# EAGLE design me433mtc (EAGLE 7.5.0)
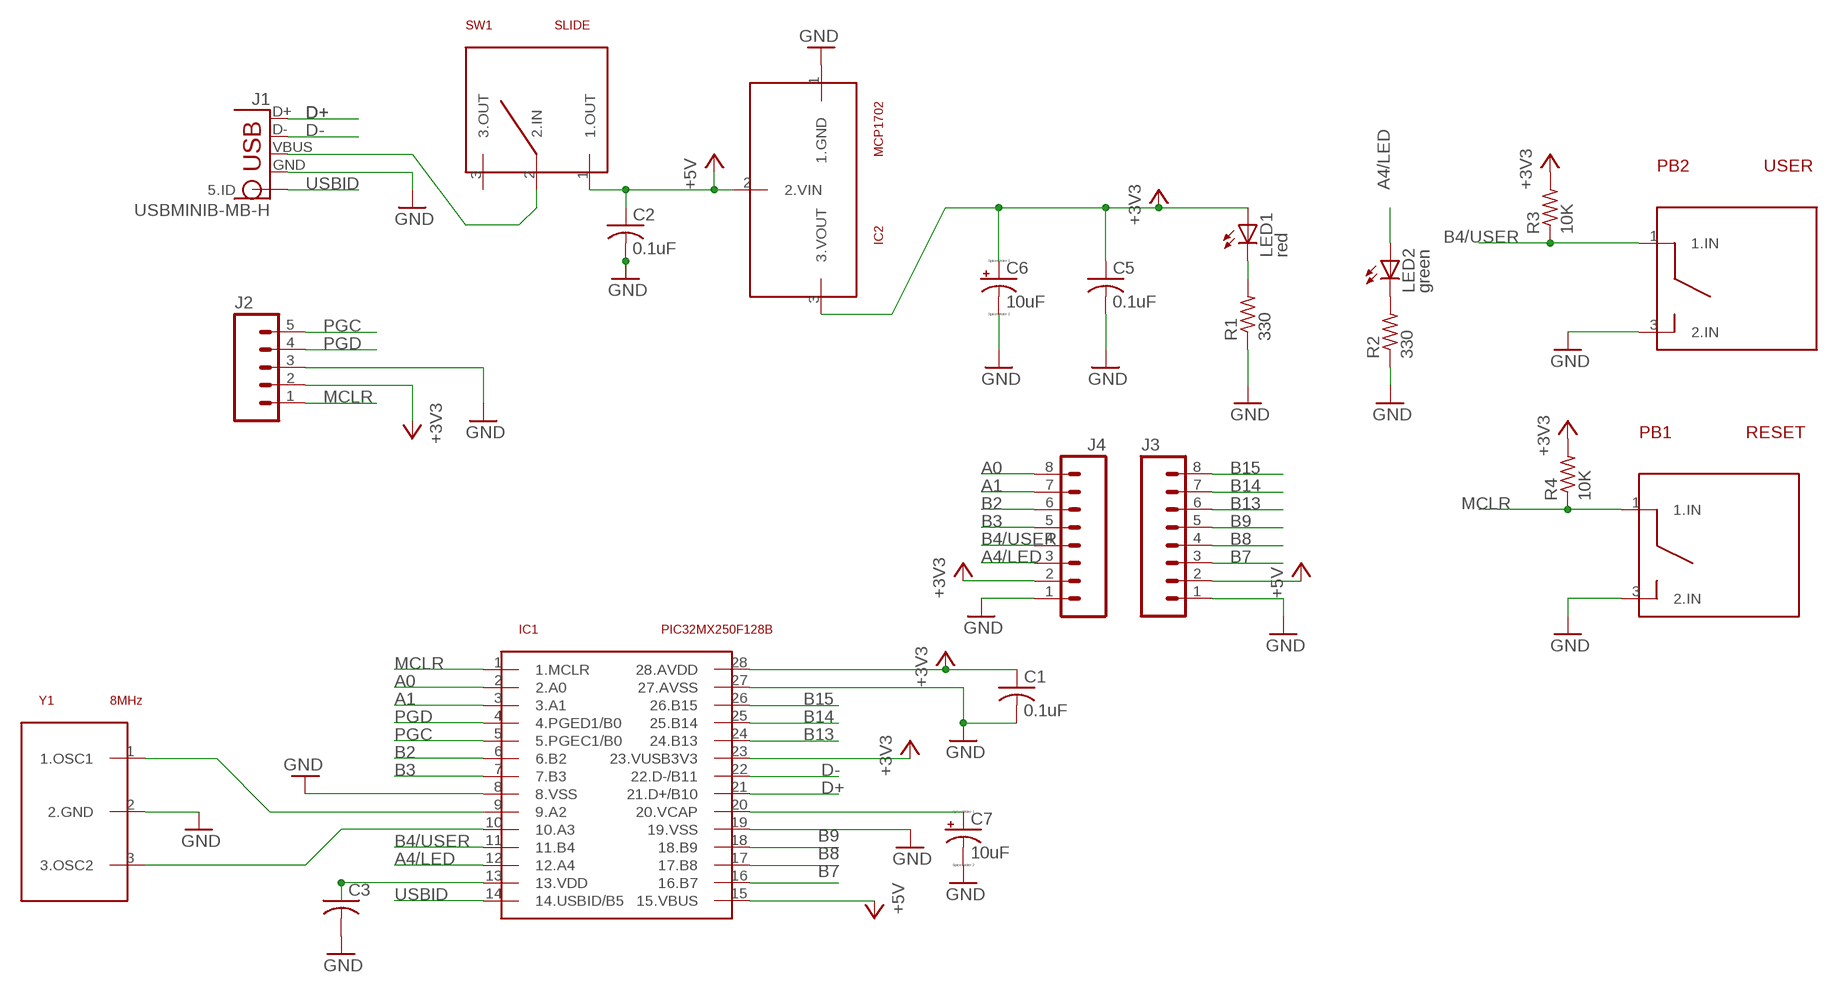
[diagram p0: schematic, sheet 1]

## Parts
C1  0.1uF  C-US025-025X050  [C025-025X050]
C2  0.1uF  C-US025-025X050  [C025-025X050]
C3  C-US025-025X050  [C025-025X050]
C5  0.1uF  C-US025-025X050  [C025-025X050]
C6  10uF  CPOL-USB45181B  [B45181B]
C7  10uF  CPOL-USB45181B  [B45181B]
IC1  PIC32MX250F128B  PIC32  [DIL28-3]
IC2  MCP1702  [TO92]
J1  USBMINIB-MB-H  [USB-MB-H]
J2  M05PTH  [1X05]
J3  M08  [1X08_ROUND]
J4  M08  [1X08_ROUND]
LED1  red  LED3MM  [LED3MM]
LED2  green  LED3MM  [LED3MM]
PB1  RESET  BUTTON  [1X03]
PB2  USER  BUTTON  [1X03]
R1  330  R-US_0204/7  [0204/7]
R2  330  R-US_0204/7  [0204/7]
R3  10K  R-US_0204/7  [0204/7]
R4  10K  R-US_0204/7  [0204/7]
SW1  SLIDE  [1X03]
Y1  8MHz  RESONATOR  [1X03]

## Nets
+3V3: C1.1 C3.1 C5.1 C6.+ IC1.13(13.VDD) IC1.23(23.VUSB3V3) IC1.28(28.AVDD) IC2.3(3.VOUT) J2.2 J4.2 LED1.A R3.2 R4.2
+5V: C2.1 IC1.15(15.VBUS) IC2.2(2.VIN) J3.2 SW1.1(1.OUT)
A0: IC1.2(2.A0) J4.8(A0)
A1: IC1.3(3.A1) J4.7
A4/LED: IC1.12(12.A4) J4.3 LED2.A
B2: IC1.6(6.B2) J4.6
B3: IC1.7(7.B3) J4.5
B4/USER: IC1.11(11.B4) J4.4 PB2.1(1.IN) R3.1
B7: IC1.16(16.B7) J3.3
B8: IC1.17(17.B8) J3.4
B9: IC1.18(18.B9) J3.5
B13: IC1.24(24.B13) J3.6
B14: IC1.25(25.B14) J3.7
B15: IC1.26(26.B15) J3.8(A0)
D+: IC1.21(21.D+/B10) J1.D+(1.GND)
D-: IC1.22(22.D-/B11) J1.D-(2.ID)
GND: C1.2 C2.2 C3.2 C5.2 C6.- C7.- IC1.8(8.VSS) IC1.19(19.VSS) IC1.27(27.AVSS) IC2.1(1.GND) J1.GND(4.D-) J2.3 J3.1 J4.1 PB1.3(2.IN) PB2.3(2.IN) R1.1 R2.1 Y1.2(2.GND)
MCLR: IC1.1(1.MCLR) J2.1 PB1.1(1.IN) R4.1
N$1: IC1.9(9.A2) Y1.1(1.OSC1)
N$2: J1.VBUS(3.D+) SW1.2(2.IN)
N$3: LED1.K(C) R1.2
N$4: LED2.K(C) R2.2
N$7: C7.+ IC1.20(20.VCAP)
N$13: IC1.10(10.A3) Y1.3(3.OSC2)
PGC: IC1.5(5.PGEC1/B0) J2.5
PGD: IC1.4(4.PGED1/B0) J2.4
USBID: IC1.14(14.USBID/B5) J1.ID(5.ID)
Unconnected: SW1.3(3.OUT)

## Library data of the parts
C1-C3 C5 = mtcboard:C-US: CAPACITOR, American symbol
C6 C7 = mtcboard:CPOL-US: POLARIZED CAPACITOR, American symbol
IC1 = mtcboard:PIC32
IC2 = mtcboard:MCP1702
J1 = mtcboard:USBMINIB: USB Connectors USB-B-PTH is fully proven SKU : PRT-00139/CONN-08278 USB-miniB is fully proven SKU : PRT-00587 USB-A-PCB is untested. USB-A-H is throughly reviewed, but untested. Spark Fun Electronics SKU : PRT-00437 USB-B-SMT is throughly reviewed, but untested. Needs silkscreen touching up. USB-A-S has not been used/tested USB-MB-H has not been used/tested USB-MICROB has been used. CONN-09505
J2 = mtcboard:M05: Header 5 Standard 5-pin 0.1" header. Use with straight break away headers (SKU : PRT-00116), right angle break away headers (PRT-00553), swiss pins (PRT-00743), machine pins (PRT-00117), and female headers (PRT-00115). Molex polarized connector foot print use with SKU : PRT-08230 with associated crimp pins and housings.
J3 J4 = mtcboard:M08: Header 8 Standard 8-pin 0.1" header. Use with straight break away headers (SKU : PRT-00116), right angle break away headers (PRT-00553), swiss pins (PRT-00743), machine pins (PRT-00117), and female headers (PRT-00115).; PROD_ID: CONN-08437
LED1 LED2 = mtcboard:LED: LED OSRAM: - CHIPLED LG R971, LG N971, LY N971, LG Q971, LY Q971, LO R971, LY R971 LH N974, LH R974 LS Q976, LO Q976, LY Q976 LO Q996 - Hyper CHIPLED LW Q18S LB Q993, LB Q99A, LB R99A - SideLED LS A670, LO A670, LY A670, LG A670, LP A670 LB A673, LV A673, LT A673, LW A673 LH A674 LY A675 LS A676, LA A676, LO A676, LY A676, LW A676 LS A679, LY A679, LG A679 - Hyper Micro SIDELED® LS Y876, LA Y876, LO Y876, LY Y876 LT Y87S - SmartLED LW L88C, LW L88S LB L89C, LB L89S, LG L890 LS L89K, LO L89K, LY L89K LS L896, LA L896, LO L896, LY L896 - TOPLED LS T670, LO T670, LY T670, LG T670, LP T670 LSG T670, LSP T670, LSY T670, LOP T670, LYG T670 LG T671, LOG T671, LSG T671 LB T673, LV T673, LT T673, LW T673 LH T674 LS T676, LA T676, LO T676, LY T676, LB T676, LH T676, LSB T676, LW T676 LB T67C, LV T67C, LT T67C, LS T67K, LO T67K, LY T67K, LW E67C LS E67B, LA E67B, LO E67B, LY E67B, LB E67C, LV E67C, LT E67C LW T67C LS T679, LY T679, LG T679 LS T770, LO T770, LY T770, LG T770, LP T770 LB T773, LV T773, LT T773, LW T773 LH T774 LS E675, LA E675, LY E675, LS T675 LS T776, LA T776, LO T776, LY T776, LB T776 LHGB T686 LT T68C, LB T68C - Hyper Mini TOPLED® LB M676 - Mini TOPLED Santana® LG M470 LS M47K, LO M47K, LY M47K Source: http://www.osram.convergy.de LUXEON: - LUMILED® LXK2-PW12-R00, LXK2-PW12-S00, LXK2-PW14-U00, LXK2-PW14-V00 LXK2-PM12-R00, LXK2-PM12-S00, LXK2-PM14-U00 LXK2-PE12-Q00, LXK2-PE12-R00, LXK2-PE12-S00, LXK2-PE14-T00, LXK2-PE14-U00 LXK2-PB12-K00, LXK2-PB12-L00, LXK2-PB12-M00, LXK2-PB14-N00, LXK2-PB14-P00, LXK2-PB14-Q00 LXK2-PR12-L00, LXK2-PR12-M00, LXK2-PR14-Q00, LXK2-PR14-R00 LXK2-PD12-Q00, LXK2-PD12-R00, LXK2-PD12-S00 LXK2-PH12-R00, LXK2-PH12-S00 LXK2-PL12-P00, LXK2-PL12-Q00, LXK2-PL12-R00 Source: www.luxeon.com KINGBRIGHT: KA-3528ASYC Source: www.kingbright.com
PB1 PB2 = mtcboard:BUTTON
R1-R4 = mtcboard:R-US_: RESISTOR, American symbol
SW1 = mtcboard:SLIDE
Y1 = mtcboard:RESONATOR

## Board
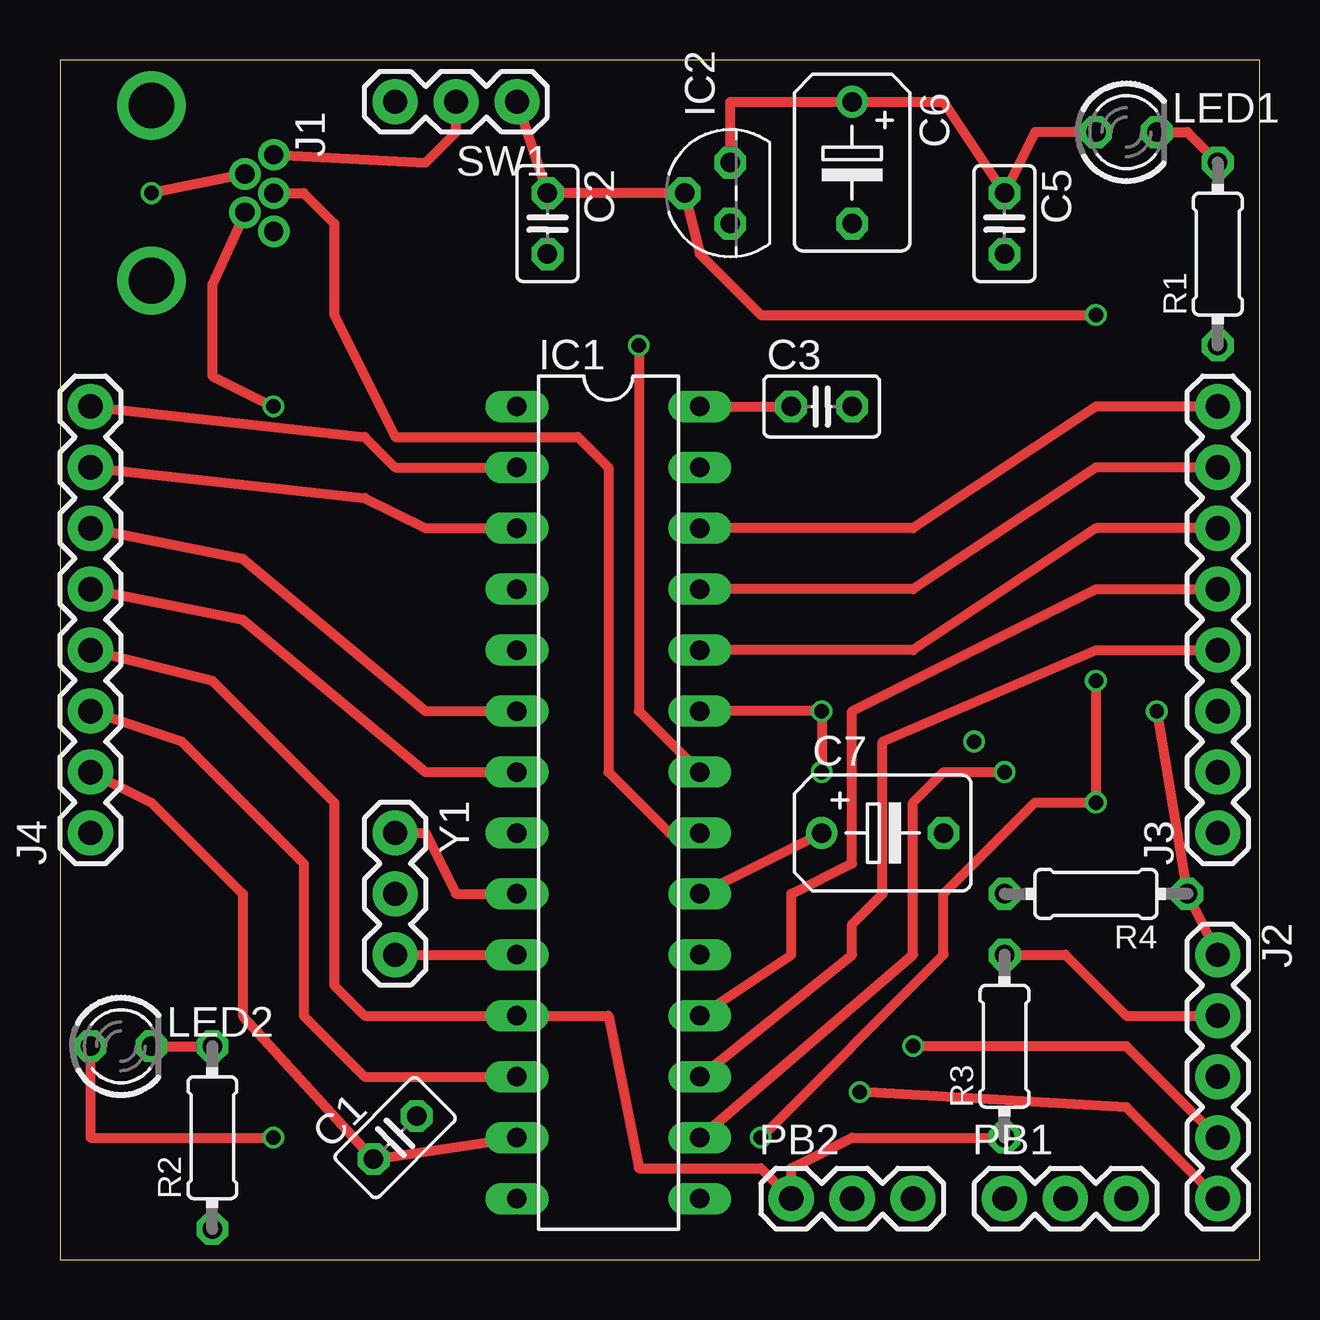
[diagram p1: board, top side]
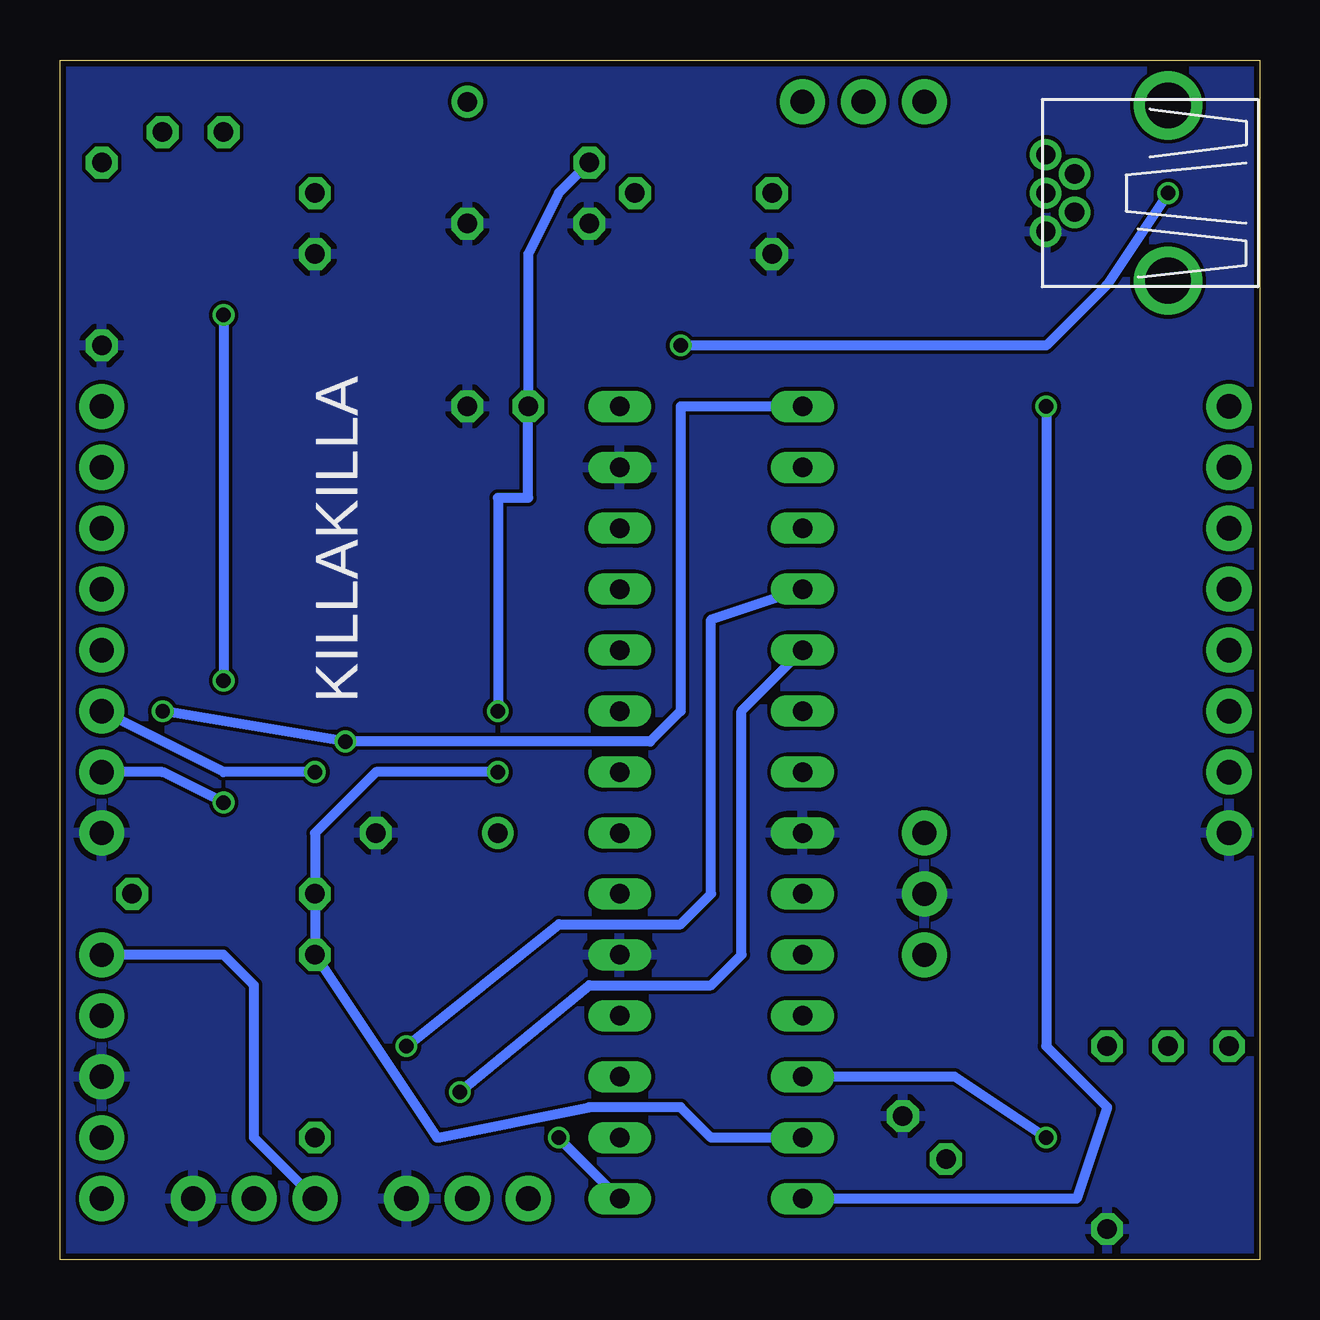
[diagram p2: board, bottom side, seen from below]

Size 50 x 50 mm. Coordinates in mm from the lower left corner, seen from the top.
Outline: 0,0 50,0 50,50 0,50 0,0
Copper layers (1*16): Top 0.035mm / dielectric 1.5mm / Bottom 0.035mm
Design rules "SeeedStudio_2layer_DRU_no_angle_20140221": minimum track width 6mil, minimum drill 12mil, track to track 6mil, track to pad 6mil, pad to pad 6mil, via to via 6mil, smd to smd 0mil, copper to edge 10mil, drill to drill 10mil, minimum pad ring 10mil, minimum via ring 6mil, stop-mask expansion 2mil, vias tented up to drill 100mil, thermal gap 10mil

### Footprints (pad centres in the part's own frame; a part is rotated, then mirrored left to right if it is on the bottom)
C025-025X050 = drill 0.813 octagon: 1 -1.27,0; 2 1.27,0
B45181B = drill 0.813: + -2.54,0 | drill 0.813 octagon: - 2.54,0
DIL28-3 = drill 0.813 long: 1 -16.51,-3.81; 2 -13.97,-3.81; 3 -11.43,-3.81; 4 -8.89,-3.81; 5 -6.35,-3.81; 6 -3.81,-3.81; 7 -1.27,-3.81; 8 1.27,-3.81; 9 3.81,-3.81; 10 6.35,-3.81; 11 8.89,-3.81; 12 11.43,-3.81; 13 13.97,-3.81; 14 16.51,-3.81; 15 16.51,3.81; 16 13.97,3.81; 17 11.43,3.81; 18 8.89,3.81; 19 6.35,3.81; 20 3.81,3.81; 21 1.27,3.81; 22 -1.27,3.81; 23 -3.81,3.81; 24 -6.35,3.81; 25 -8.89,3.81; 26 -11.43,3.81; 27 -13.97,3.81; 28 -16.51,3.81
TO92 = drill 0.813 octagon: 1 -1.27,0; 2 0,1.905; 3 1.27,0
USB-MB-H = drill 0.8: D+ 5.1,0; D- 3.9,0.8; GND 5.1,-1.6; ID 3.9,-0.8; VBUS 5.1,1.6 | drill 1.9: P$6 0,-3.65; P$7 0,3.65
1X05 = drill 1.016 pad 1.88: 1 0,0; 2 2.54,0; 3 5.08,0; 4 7.62,0; 5 10.16,0
1X08_ROUND = drill 1.016 pad 1.88: 1 0,0; 2 2.54,0; 3 5.08,0; 4 7.62,0; 5 10.16,0; 6 12.7,0; 7 15.24,0; 8 17.78,0
LED3MM = drill 0.813 octagon: A -1.27,0; K 1.27,0
1X03 = drill 1.016 pad 1.88: 1 0,0; 2 2.54,0; 3 5.08,0
0204/7 = drill 0.813 octagon: 1 -3.81,0; 2 3.81,0

### Placement (x,y rotation side)
C1  13.97,5.08 45 top
C2  20.32,43.18 270 top
C3  31.75,35.56 0 top
C5  39.37,43.18 270 top
C6  33.02,45.72 270 top
C7  34.29,17.78 0 top
IC1  22.86,19.05 270 top
IC2  27.94,44.45 90 top
J1  3.81,44.45 0 top
J2  48.26,12.7 270 top
J3  48.26,17.78 90 top
J4  1.27,17.78 90 top
LED1  44.45,46.99 0 top
LED2  2.54,8.89 0 top
PB1  39.37,2.54 0 top
PB2  30.48,2.54 0 top
R1  48.26,41.91 90 top
R2  6.35,5.08 90 top
R3  39.37,8.89 90 top
R4  43.18,15.24 180 top
SW1  19.05,48.26 180 top
Y1  13.97,17.78 270 top

### Tracks (layer width: path | path; a pad name or v marks a point on that pad's centre or on a via)
+3V3  (via drill 0.6)
  Top 0.406: J4.2 3.81,19.05 7.62,15.24 7.62,10.16 C1.1 IC1.13 | IC2.3 27.94,48.26 C6.+ 36.83,48.26 C5.1 40.64,46.99 LED1.A | IC1.28 C3.1 | IC1.23 v31.75,22.86 v31.75,20.32 | R3.2 41.91,12.7 44.45,10.16 J2.2
  Bottom 0.406: IC1.13 22.86,5.08 24.13,6.35 27.94,6.35 34.29,5.08 R3.2 R4.2 39.37,17.78 36.83,20.32 v31.75,20.32 | v31.75,22.86 31.75,31.75 30.48,31.75 C3.1 30.48,41.91 29.21,44.45 IC2.3
+5V  (via drill 0.6)
  Top 0.406: SW1.1 C2.1 IC2.2 26.67,41.91 29.21,39.37 v43.18,39.37 | v29.21,5.08 36.83,12.7 36.83,15.24 40.64,19.05 v43.18,19.05 v43.18,24.13
  Bottom 0.406: IC1.15 v29.21,5.08 | v43.18,19.05 45.72,20.32 J3.2 | v43.18,39.37 v43.18,24.13
A0
  Top 0.406: J4.8 12.7,34.29 13.97,33.02 IC1.2
A1
  Top 0.406: J4.7 12.7,31.75 15.24,30.48 IC1.3
A4/LED  (via drill 0.6)
  Top 0.406: J4.3 5.08,21.59 10.16,16.51 10.16,10.16 12.7,7.62 IC1.12 | LED2.A 1.27,5.08 v8.89,5.08
  Bottom 0.406: v8.89,5.08 12.7,7.62 IC1.12
B2
  Top 0.406: J4.6 7.62,29.21 15.24,22.86 IC1.6
B3
  Top 0.406: J4.5 7.62,26.67 15.24,20.32 IC1.7
B4/USER
  Top 0.406: J4.4 6.35,24.13 11.43,19.05 11.43,11.43 12.7,10.16 IC1.11 22.86,10.16 24.13,3.81 29.21,3.81 PB2.1 30.48,3.81 33.02,5.08 R3.1
B7  (via drill 0.6)
  Top 0.406: IC1.16 35.56,12.7 35.56,19.05 36.83,20.32 v39.37,20.32
  Bottom 0.406: v39.37,20.32 43.18,20.32 J3.3
B8
  Top 0.406: IC1.17 33.02,12.7 33.02,13.97 34.29,15.24 34.29,21.59 43.18,25.4 J3.4
B9
  Top 0.406: IC1.18 30.48,12.7 30.48,15.24 33.02,16.51 33.02,22.86 43.18,27.94 J3.5
B13
  Top 0.406: J3.6 43.18,30.48 35.56,25.4 IC1.24
B14
  Top 0.406: J3.7 43.18,33.02 35.56,27.94 IC1.25
B15
  Top 0.406: J3.8 43.18,35.56 35.56,30.48 IC1.26
D+
  Top 0.406: J1.D+ 10.16,44.45 11.43,43.18 11.43,39.37 13.97,34.29 21.59,34.29 22.86,33.02 22.86,20.32 25.4,17.78 IC1.21
D-  (via drill 0.6)
  Top 0.406: J1.D- v3.81,44.45 | v24.13,38.1 24.13,22.86 IC1.22
  Bottom 0.406: v3.81,44.45 6.35,40.64 8.89,38.1 v24.13,38.1
GND
  pour Bottom: -3.81,52.07 -5.08,52.07 -5.08,-10.16 55.88,-10.16 55.88,-5.08 55.88,53.34 -3.81,53.34
MCLR  (via drill 0.6)
  Top 0.406: J2.1 R4.1 v45.72,22.86
  Bottom 0.406: IC1.1 24.13,35.56 24.13,22.86 25.4,21.59 v38.1,21.59 v45.72,22.86 | PB1.1 41.91,5.08 41.91,11.43 43.18,12.7 J2.1
N$1
  Top 0.406: Y1.1 15.24,17.78 16.51,15.24 IC1.9
N$2
  Top 0.406: J1.VBUS 15.24,45.72 16.51,46.99 SW1.2
N$3
  Top 0.406: LED1.K 46.99,46.99 R1.2
N$4
  Top 0.406: LED2.K R2.2
N$7
  Top 0.406: IC1.20 C7.+
N$13
  Top 0.406: Y1.3 IC1.10
PGC  (via drill 0.6)
  Top 0.406: J2.5 44.45,6.35 v33.34,6.99
  Bottom 0.406: v33.34,6.99 27.94,11.43 22.86,11.43 21.59,12.7 21.59,22.86 IC1.5
PGD  (via drill 0.6)
  Top 0.406: J2.4 44.45,8.89 v35.56,8.89
  Bottom 0.406: v35.56,8.89 29.21,13.97 24.13,13.97 22.86,15.24 22.86,26.67 IC1.4
USBID  (via drill 0.6)
  Top 0.406: J1.ID 6.35,40.64 6.35,36.83 v8.89,35.56
  Bottom 0.406: v8.89,35.56 8.89,8.89 6.35,6.35 7.62,2.54 IC1.14

### Text on the board
bPlace: KILLAKILLA